# Altium schematic sheet ecs8a_sch_v3_bottom.SchDoc
size A4
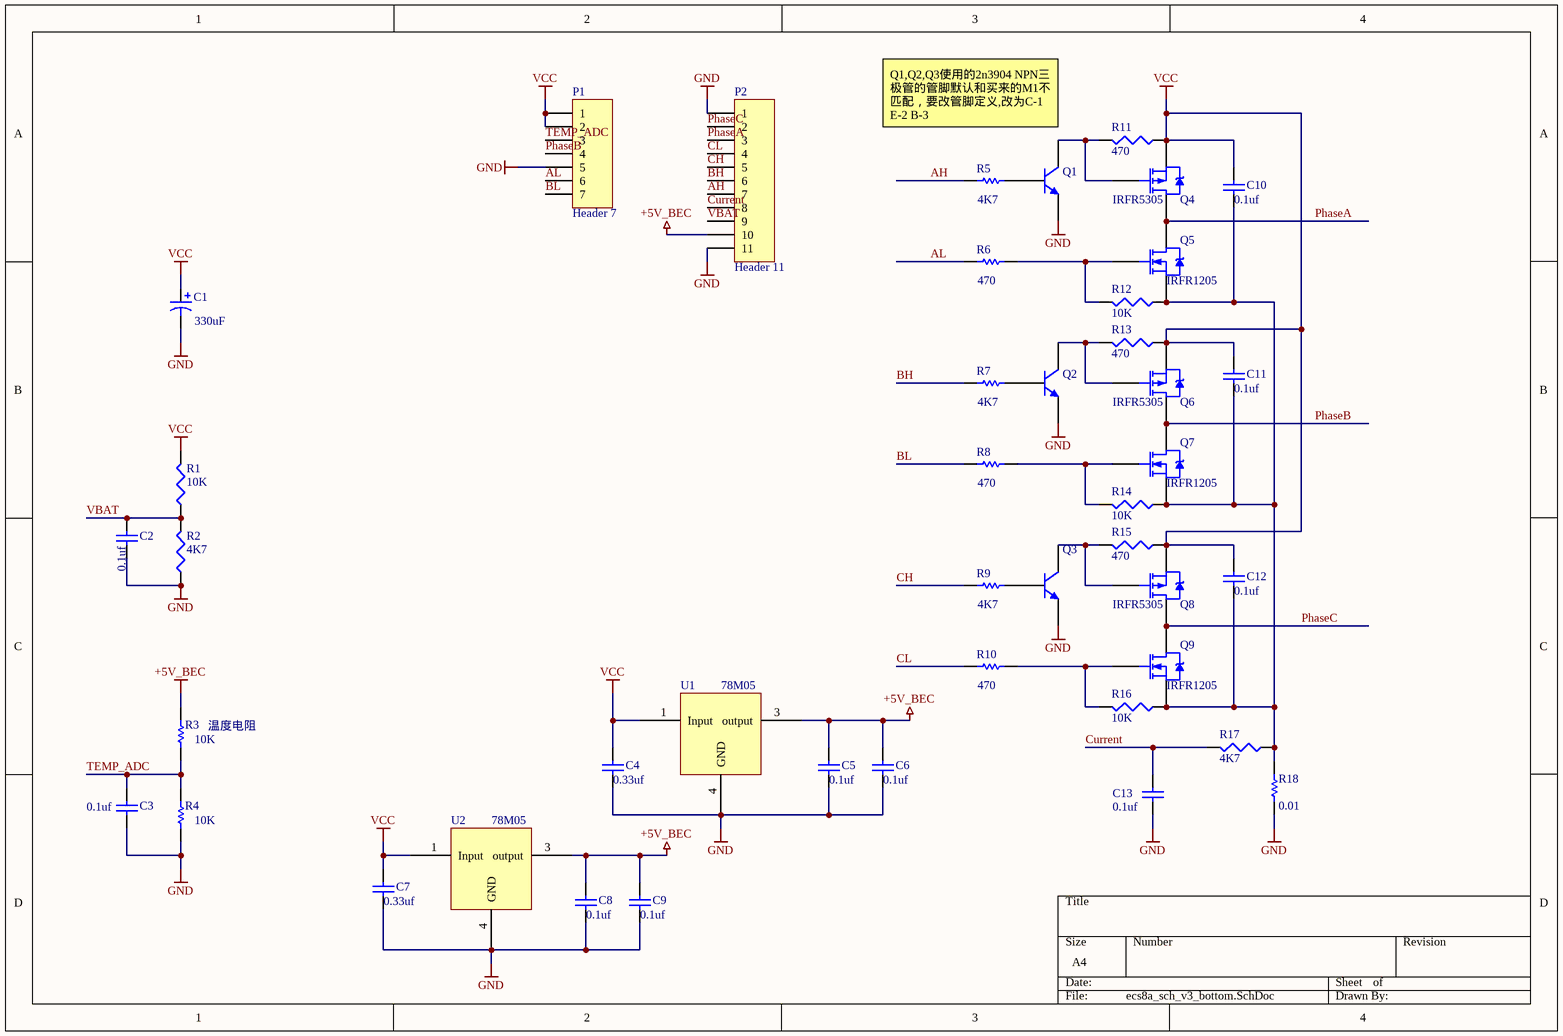
[diagram p0: ecs8a_sch_v3_bottom.SchDoc]

## Parts
C1  value 330uF  [D_C]  (hidden comment: Cap Pol1)
C2  value 0.1uf  [6-0805_L]  (hidden comment: Cap)
C3  value 0.1uf  [6-0805_L]  (hidden comment: Cap)
C4  value 0.33uf  [C1206]  (hidden comment: Cap)
C5  value 0.1uf  [6-0805_L]  (hidden comment: Cap)
C6  value 0.1uf  [6-0805_L]  (hidden comment: Cap)
C7  value 0.33uf  [C1206]  (hidden comment: Cap)
C8  value 0.1uf  [6-0805_L]  (hidden comment: Cap)
C9  value 0.1uf  [6-0805_L]  (hidden comment: Cap)
C10  value 0.1uf  [6-0805_L]  (hidden comment: Cap)
C11  value 0.1uf  [6-0805_L]  (hidden comment: Cap)
C12  value 0.1uf  [6-0805_L]  (hidden comment: Cap)
C13  value 0.1uf  [6-0805_L]  (hidden comment: Cap)
P1  Header 7  [7PIN_2.54]
P2  Header 11  [11PIN_2.54]
Q1  2N3904  [SOT23_L]  (value not drawn)
Q2  2N3904  [SOT23_L]  (value not drawn)
Q3  2N3904  [SOT23_L]  (value not drawn)
Q4  IRFR5305  [TO-252AA]
Q5  IRFR1205  [TO-252AA]
Q6  IRFR5305  [TO-252AA]
Q7  IRFR1205  [TO-252AA]
Q8  IRFR5305  [TO-252AA]
Q9  IRFR1205  [TO-252AA]
R1  value 10K  [6-0805_L]  (hidden comment: Res3)
R2  value 4K7  [6-0805_L]  (hidden comment: Res3)
R3  温度电阻  value 10K  [6-0805_L]
R4  value 10K  [6-0805_L]  (hidden comment: Res1)
R5  value 4K7  [6-0805_L]  (hidden comment: Res1)
R6  value 470  [6-0805_L]  (hidden comment: Res1)
R7  value 4K7  [6-0805_L]  (hidden comment: Res1)
R8  value 470  [6-0805_L]  (hidden comment: Res1)
R9  value 4K7  [6-0805_L]  (hidden comment: Res1)
R10  value 470  [6-0805_L]  (hidden comment: Res1)
R11  value 470  [6-0805_L]  (hidden comment: Res3)
R12  value 10K  [6-0805_L]  (hidden comment: Res3)
R13  value 470  [6-0805_L]  (hidden comment: Res3)
R14  value 10K  [6-0805_L]  (hidden comment: Res3)
R15  value 470  [6-0805_L]  (hidden comment: Res3)
R16  value 10K  [6-0805_L]  (hidden comment: Res3)
R17  value 4K7  [6-0805_L]  (hidden comment: Res3)
R18  value 0.01  [2512_R]  (hidden comment: Res1)
U1  78M05  [TO-252AA]
U2  78M05  [TO-252AA]

## Nets
+5V_BEC: C5.1 C6.1 C8.1 C9.1 P2.10 R3.2 U1.3(output) U2.3(output)
GND: C1.2 C2.2 C3.1 C4.2 C5.2 C6.2 C7.2 C8.2 C9.2 C13.1 P1.5 P2.1 P2.11 Q1.2(E) Q2.2(E) Q3.2(E) R2.1 R4.1 R18.1 U1.4(GND) U2.4(GND)
VCC: C1.1 C4.1 C7.1 C10.2 C11.2 C12.2 P1.1 P1.2 Q4.3(S) Q6.3(S) Q8.3(S) R1.2 R11.1 R13.1 R15.1 U1.1(Input) U2.1(Input)
AH: P2.7 R5.2
AL: P1.6 R6.2
BH: P2.6 R7.2
BL: P1.7 R8.2
CH: P2.5 R9.2
CL: P2.4 R10.2
Current: C13.2 P2.8 R17.2
PhaseA: P2.3 Q4.4(D) Q5.4(D)
PhaseB: P1.4 Q6.4(D) Q7.4(D)
PhaseC: P2.2 Q8.4(D) Q9.4(D)
TEMP_ADC: C3.2 P1.3 R3.1 R4.2
VBAT: C2.1 P2.9 R1.1 R2.2
NetC10_1: C10.1 C11.1 C12.1 Q5.3(S) Q7.3(S) Q9.3(S) R12.1 R14.1 R16.1 R17.1 R18.2
NetQ1_1: Q1.1(C) Q4.1(G) R11.2
NetQ1_3: Q1.3(B) R5.1
NetQ2_1: Q2.1(C) Q6.1(G) R13.2
NetQ2_3: Q2.3(B) R7.1
NetQ3_1: Q3.1(C) Q8.1(G) R15.2
NetQ3_3: Q3.3(B) R9.1
NetQ5_1: Q5.1(G) R6.1 R12.2
NetQ7_1: Q7.1(G) R8.1 R14.2
NetQ9_1: Q9.1(G) R10.1 R16.2

## Notes on the sheet
- Q1,Q2,Q3使用的2n3904 NPN三极管的管脚默认和买来的M1不匹配，要改管脚定义,改为C-1 E-2 B-3

## Library data of the parts
C1 = Cap Pol1: Polarized Capacitor (Radial); Published: 8-Jun-2000; LatestRevisionDate: 17-Jul-2002; LatestRevisionNote: Re-released for DXP Platform.; PackageReference: RB7.6-15; Publisher: Altium Limited; PackageDescription: Polarized Capacitor (Radial); 2 Leads
C2-C13 = Cap: Capacitor; Published: 8-Jun-2000; LatestRevisionDate: 17-Jul-2002; LatestRevisionNote: Re-released for DXP Platform.; PackageReference: RAD-0.3; Publisher: Altium Limited; PackageDescription: Radial Cap, Thru-Hole; 2 Leads; 0.3 in Pin Spacing
P1 = Header 7: Header, 7-Pin; LatestRevisionDate: 17-Jul-2002; LatestRevisionNote: Re-released for DXP Platform.; Publisher: Altium Limited
P2 = Header 11: Header, 11-Pin; LatestRevisionDate: 17-Jul-2002; LatestRevisionNote: Re-released for DXP Platform.; Publisher: Altium Limited
Q1-Q3 = 2N3904: NPN General Purpose Amplifier; Published: 8-Jun-2000; LatestRevisionDate: 15-Jan-2003; LatestRevisionNote: PCB Footprint 'BCY-W3/D4.7' replaced; DatasheetVersion: 1997; PackageVersion: Sep-1998; PackageReference: TO-92A; Publisher: Altium Limited; PackageDescription: TO, Flat Index; 3 In-Line, Axial Leads; Body Dia. 4.5mm; Leads 0.51 x 0.48 mm (max); ComponentLink1Description: Manufacturer Link; ComponentLink1URL: http://www.fairchildsemi.com/; ComponentLink2Description: Datasheet; ComponentLink2URL: http://www.fairchildsemi.com/ds/2N%2F2N3904.pdf
Q4 Q6 Q8 = IRFR5305: HEXFET Power MOSFET; Manufacturer: International Rectifier; Class I: Discrete; Class II: MOSFET - Power; Note: Pin 2 is trimmed and is electrically connected to Drain.; Published: 8-Jun-2000; Revision: July-2002: Re-released for DXP Platform.; Datasheet: Latest Revision: PD-9.1402; Package Reference: TO-252AA; Publisher: Altium Limited
Q5 Q7 Q9 = IRFR1205: HEXFET Power MOSFET; Manufacturer: International Rectifier; Class I: Discrete; Class II: MOSFET - Power; Note: Pin 2 is trimmed and is electrically connected to Drain.; Published: 8-Jun-2000; Revision: July-2002: Re-released for DXP Platform.; Datasheet: Latest Revision: PD-91318B; Package Reference: TO-252AA; Publisher: Altium Limited
R1 R2 R11-R17 = Res3: Resistor; Published: 8-Jun-2000; LatestRevisionDate: 29-May-2009; LatestRevisionNote: IPC-7351 Footprint Added.; PackageReference: J1-0603; Publisher: Altium Limited; PackageDescription: Chip Resistor
R3-R10 R18 = Res1: Resistor; Published: 8-Jun-2000; LatestRevisionDate: 17-Jul-2002; LatestRevisionNote: Re-released for DXP Platform.; PackageReference: AXIAL-0.3; Publisher: Altium Limited; PackageDescription: Axial Device, Thru-Hole; 2 Leads; 0.3 in Pin Spacing
U1 U2 = Component_1